# Altium project PSU-USB.PrjPcb
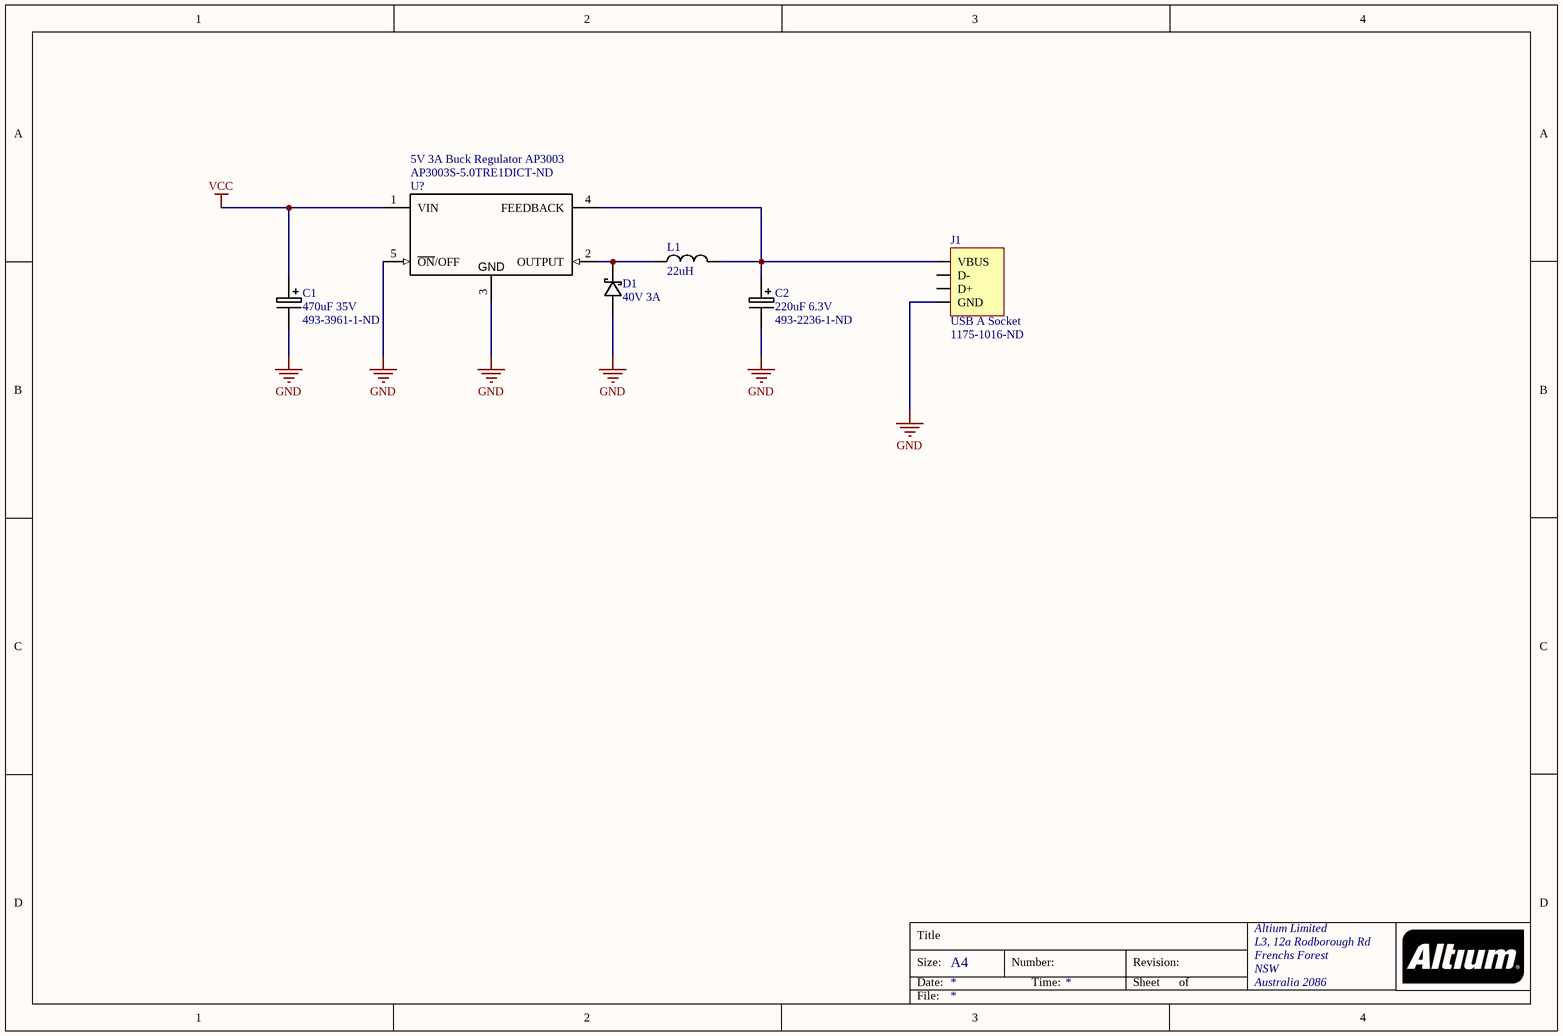
[diagram p0: psu-usb.SchDoc]
1 sheet, 6 parts. Net scope: global (net labels, ports and power ports of the same name join across sheets).
Board file: psu-usb.PcbDoc

## Sheet psu-usb.SchDoc
size A4; Organization: Altium Limited; Address1: L3, 12a Rodborough Rd; Address2: Frenchs Forest; Address3: NSW; Address4: Australia 2086

### Parts
C1  470uF 35V  Supplier Part Number 1: 493-3961-1-ND  [UCL1V471MNL1GS]
C2  220uF 6.3V  Supplier Part Number 1: 493-2236-1-ND  [UUD0J221MCL1GS]
D1  40V 3A  [DO-214AB]
J1  USB A Socket  Supplier Part Number 1: 1175-1016-ND  [USB A Socket - 1002-002-01100]
L1  22uH  [CDRH127/LDNP]
U1  5V 3A Buck Regulator AP3003  Supplier Part Number 1: AP3003S-5.0TRE1DICT-ND  [TO-263-5]

### Nets
GND: C1.2 C2.2 D1.A J1.4(GND) U1.3(GND) U1.5(~{ON}/OFF)
VCC: C1.1 U1.1(VIN)
NetC2_1: C2.1 J1.1(VBUS) L1.1 U1.4(FEEDBACK)
NetD1_K: D1.K L1.0 U1.2(OUTPUT)

Not connected (* = marked no-connect by the designer): J1 2(D-) 3(D+)

### Notes on the sheet
- Title
- Size:
- Date:
- A4
- Number:
- Time:
- Revision:
- Sheet
- of
- File:

### Library data of the parts
C1 = CAPE 470uF 35V UCL1V471MNL1GS: Supplier 1: Digi-Key
C2 = CAPE 220uF 6.3V UUD0J221MCL1GS: Supplier 1: Digi-Key
D1 = B340-13-F: Supplier 1: Digi-Key; Supplier Part Number 1: B340-FDIDKR-ND
L1 = CDRH127/LDNP-220MC: Supplier 1: Digi-Key; Supplier Part Number 1: 308-1335-6-ND
J1 = USB A Socket: Supplier 1: Digi-Key
U? = 5V 3A Buck Regulator AP3003: Supplier 1: Digi-Key